# EAGLE design Ant-v1 (EAGLE 6.3)
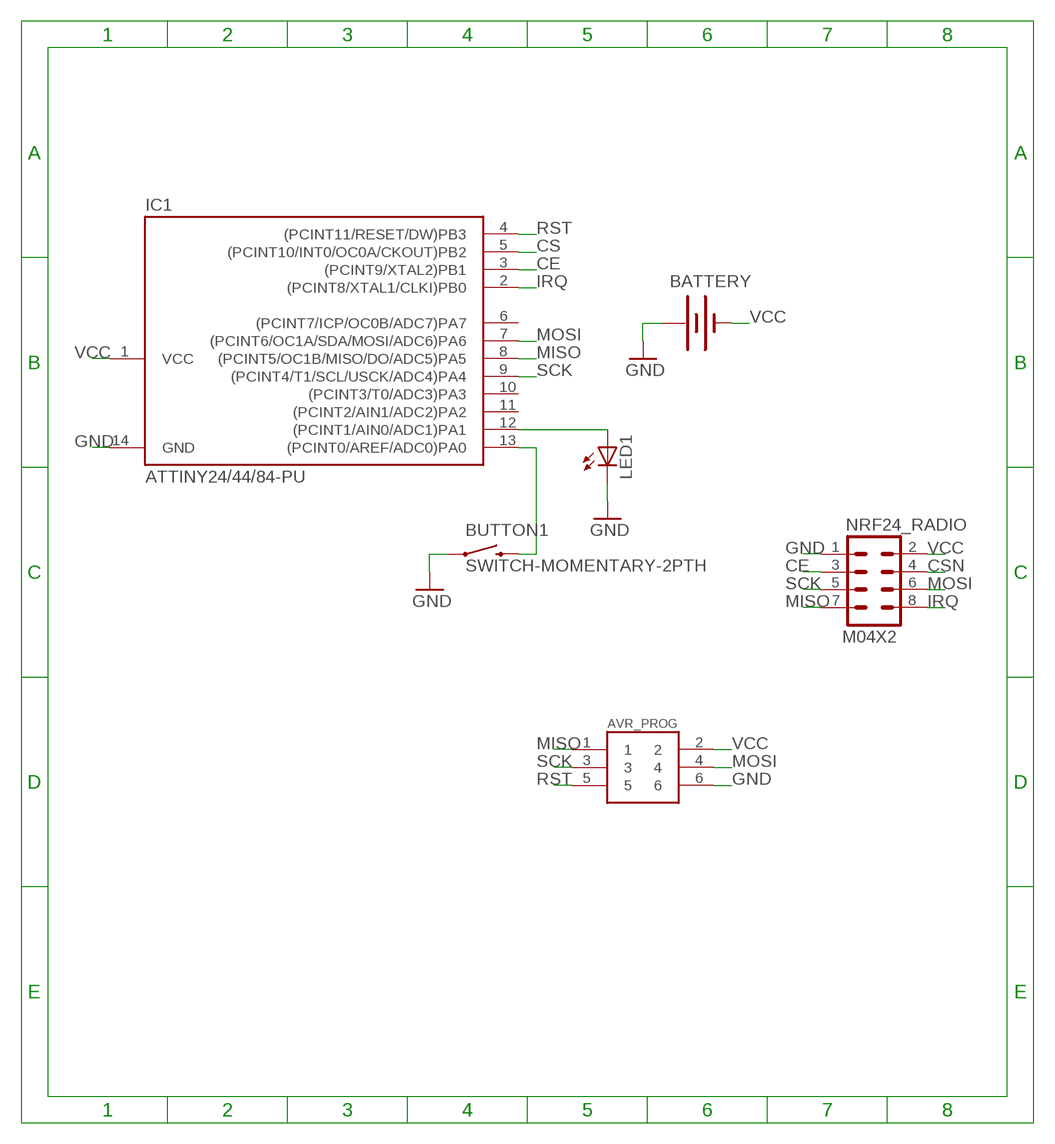
[diagram p0: schematic, sheet 1]

## Parts
AVR_PROG  M03X2  [2X3-SHROUDED]
BATTERY  BATTERY20PTH  [BATTCOM_20MM_PTH]
BUTTON1  SWITCH-MOMENTARY-2PTH  [TACTILE-PTH]
IC1  ATTINY24/44/84-PU  [DIL14]
LED1  LED3MM  [LED3MM]
NRF24_RADIO  M04X2  [2X4]

## Nets
CE: IC1.3((PCINT9/XTAL2)PB1) NRF24_RADIO.3
CS: IC1.5((PCINT10/INT0/OC0A/CKOUT)PB2)
CSN: NRF24_RADIO.4
GND: AVR_PROG.6 BATTERY.1(+) BUTTON1.1 IC1.14(GND) LED1.K(C) NRF24_RADIO.1
IRQ: IC1.2((PCINT8/XTAL1/CLKI)PB0) NRF24_RADIO.8
MISO: AVR_PROG.1 IC1.8((PCINT5/OC1B/MISO/DO/ADC5)PA5) NRF24_RADIO.7
MOSI: AVR_PROG.4 IC1.7((PCINT6/OC1A/SDA/MOSI/ADC6)PA6) NRF24_RADIO.6
N$3: IC1.12((PCINT1/AIN0/ADC1)PA1) LED1.A
N$4: BUTTON1.3 IC1.13((PCINT0/AREF/ADC0)PA0)
RST: AVR_PROG.5 IC1.4((PCINT11/RESET/DW)PB3)
SCK: AVR_PROG.3 IC1.9((PCINT4/T1/SCL/USCK/ADC4)PA4) NRF24_RADIO.5
VCC: AVR_PROG.2 BATTERY.2(-) IC1.1(VCC) NRF24_RADIO.2
Unconnected: IC1.6((PCINT7/ICP/OC0B/ADC7)PA7) IC1.10((PCINT3/T0/ADC3)PA3) IC1.11((PCINT2/AIN1/ADC2)PA2)

## Library data of the parts
AVR_PROG = SparkFun-Connectors:M03X2: 2x3 .1" header. Shrouded, with keying- CONN-10681 SMT- ??? (4UCON 15881); PROD_ID: CONN-10681
BATTERY = SparkFun-Electromechanical:BATTERY: Battery Holders Various common sizes : AA, AAA, 20mm coin cell and 12mm coin cell. 20MM_4LEGS, BATT-10373
BUTTON1 = SparkFun-Electromechanical:SWITCH-MOMENTARY-2: Various NO switches- pushbuttons, reed, etc
IC1 = attiny24_44_84:ATTINY24/44/84
LED1 = SparkFun-LED:LED: LEDs Standard schematic elements and footprints for 5mm, 3mm, 1206, and 0603 sized LEDs. 5mm - Spark Fun Electronics SKU : COM-00529 (and others)
NRF24_RADIO = SparkFun-Connectors:M04X2: .1" header, two rows of four.

## Board
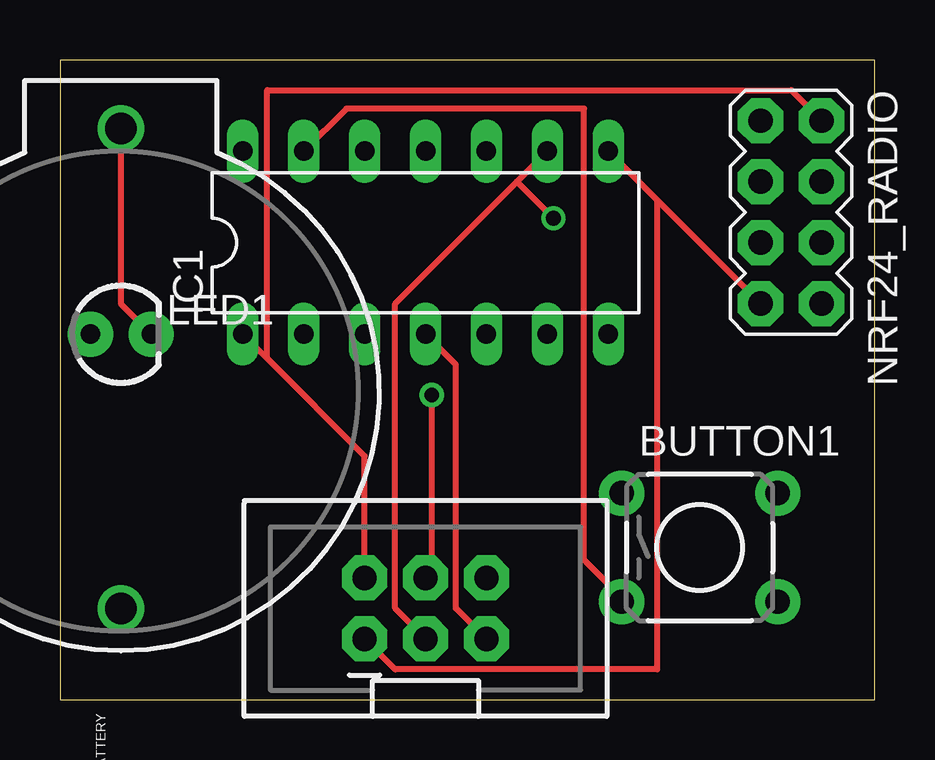
[diagram p1: board, top side]
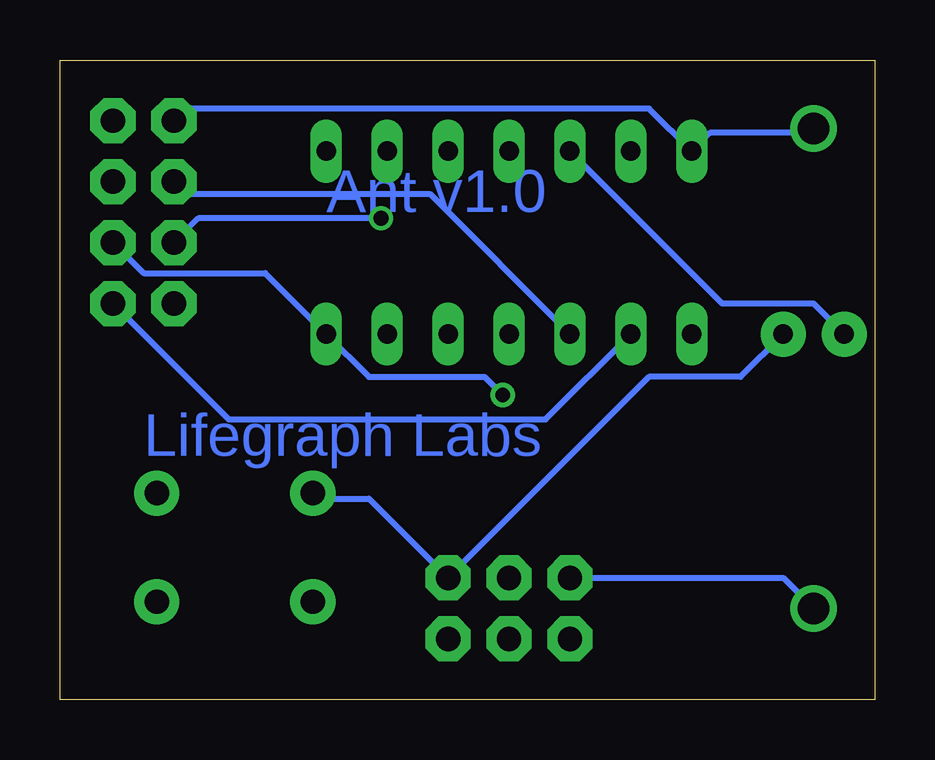
[diagram p2: board, bottom side, seen from below]

Size 33.96 x 26.66 mm. Coordinates in mm from the lower left corner, seen from the top.
Outline: 0,0 33.96,0 33.96,26.66 0,26.66 0,0
Copper layers (1*16): Top 0.035mm / dielectric 1.5mm / Bottom 0.035mm
Design rules "default": minimum track width 10mil, minimum drill 24mil, track to track 8mil, track to pad 8mil, pad to pad 8mil, via to via 8mil, smd to smd 8mil, copper to edge 40mil, drill to drill 8mil, minimum pad ring 10mil, minimum via ring 8mil, stop-mask expansion 4mil, vias tented up to drill 0mil, thermal gap 10mil

### Footprints (pad centres in the part's own frame; a part is rotated, then mirrored left to right if it is on the bottom)
2X3-SHROUDED = drill 1.016 pad 1.88 octagon: 1 -1.27,2.54; 2 1.27,2.54; 3 -1.27,0; 4 1.27,0; 5 -1.27,-2.54; 6 1.27,-2.54
BATTCOM_20MM_PTH = drill 1.3: 1 20,0; 2 0,0
TACTILE-PTH = drill 1.016 pad 1.88: 1 -3.251,2.261; 2 3.251,2.261; 3 -3.251,-2.261; 4 3.251,-2.261
DIL14 = drill 0.813 long: 1 -7.62,-3.81; 2 -5.08,-3.81; 3 -2.54,-3.81; 4 0,-3.81; 5 2.54,-3.81; 6 5.08,-3.81; 7 7.62,-3.81; 8 7.62,3.81; 9 5.08,3.81; 10 2.54,3.81; 11 0,3.81; 12 -2.54,3.81; 13 -5.08,3.81; 14 -7.62,3.81
LED3MM = drill 0.813 pad 1.88: A -1.27,0; K 1.27,0
2X4 = drill 1.016 pad 1.88 octagon: 1 -3.81,-1.27; 2 -3.81,1.27; 3 -1.27,-1.27; 4 -1.27,1.27; 5 1.27,-1.27; 6 1.27,1.27; 7 3.81,-1.27; 8 3.81,1.27

### Placement (x,y rotation side)
AVR_PROG  15.24,3.81 90 top
BATTERY  2.54,3.81 90 top
BUTTON1  26.67,6.35 0 top
IC1  15.24,19.05 0 top
LED1  2.54,15.24 0 top
NRF24_RADIO  30.48,20.32 270 top

### Tracks (layer width: path | path; a pad name or v marks a point on that pad's centre or on a via)
CE
  Bottom 0.254: IC1.3 18.54,21.08 28.7,21.08 NRF24_RADIO.3
GND
  Top 0.254: LED1.K 2.54,16.51 BATTERY.1
  Bottom 0.254: BUTTON1.1 23.37,8.38 21.08,8.38 AVR_PROG.6 9.4,13.46 5.59,13.46 LED1.K | BATTERY.1 2.54,23.62 6.86,23.62 IC1.14 9.4,24.64 28.7,24.64 NRF24_RADIO.1
IRQ
  Bottom 0.254: IC1.2 13.72,11.68 26.92,11.68 NRF24_RADIO.8
MISO
  Top 0.254: NRF24_RADIO.7 24.89,20.83 | 24.89,20.83 IC1.8 | AVR_PROG.1 13.97,1.27 24.89,1.27 24.89,20.83
MOSI  (via drill 0.61)
  Top 0.254: AVR_PROG.4 15.49,5.33 v15.49,12.7
  Bottom 0.254: NRF24_RADIO.6 30.48,17.78 25.4,17.78 IC1.7 21.08,13.46 16.26,13.46 v15.49,12.7
N$3
  Bottom 0.254: IC1.12 6.35,16.51 2.54,16.51 LED1.A
N$4
  Top 0.254: IC1.13 11.94,24.64 21.84,24.64 21.84,5.84 23.37,4.32 BUTTON1.3
RST
  Top 0.254: IC1.4 16.51,13.97 16.51,3.81 AVR_PROG.5
SCK  (via drill 0.61)
  Top 0.254: 19.05,21.59 13.97,16.51 13.97,3.81 AVR_PROG.3 | 19.05,21.59 IC1.9 | 19.05,21.59 v20.57,20.07
  Bottom 0.254: NRF24_RADIO.5 28.19,20.07 v20.57,20.07
VCC
  Top 0.254: 8.64,14.22 12.7,10.16 AVR_PROG.2 | 8.64,14.22 IC1.1 | NRF24_RADIO.2 30.48,25.4 8.64,25.4 8.64,14.22
  Bottom 0.254: BATTERY.2 3.81,5.08 AVR_PROG.2

### Text on the board
Bottom: Ant v1.0 | Lifegraph Labs